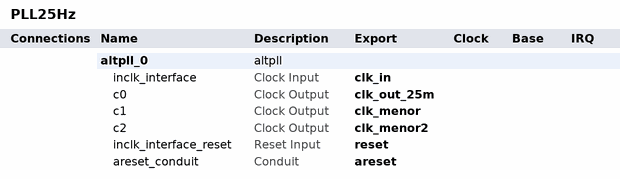
[diagram p0: system contents]
# Platform Designer (Qsys) system PLL25Hz, Cyclone IV E EP4CE115F29C7
# Parameters at their usual value, and those the tool derives, are not listed.
package require qsys
create_system PLL25Hz
set_project_property DEVICE_FAMILY {Cyclone IV E}
set_project_property DEVICE EP4CE115F29C7

add_instance altpll_0 altpll 13.1
set_instance_parameter_value altpll_0 INCLK0_INPUT_FREQUENCY 20000
set_instance_parameter_value altpll_0 CLK0_MULTIPLY_BY 1007
set_instance_parameter_value altpll_0 CLK1_MULTIPLY_BY 1
set_instance_parameter_value altpll_0 CLK2_MULTIPLY_BY 1
set_instance_parameter_value altpll_0 CLK0_DIVIDE_BY 2000
set_instance_parameter_value altpll_0 CLK1_DIVIDE_BY 5000
set_instance_parameter_value altpll_0 CLK2_DIVIDE_BY 500
set_instance_parameter_value altpll_0 CLK1_PHASE_SHIFT 0
set_instance_parameter_value altpll_0 CLK2_PHASE_SHIFT 0
set_instance_parameter_value altpll_0 CLK1_DUTY_CYCLE 50
set_instance_parameter_value altpll_0 CLK2_DUTY_CYCLE 50
set_instance_parameter_value altpll_0 PORT_clk1 PORT_USED
set_instance_parameter_value altpll_0 PORT_clk2 PORT_USED
set_instance_parameter_value altpll_0 PORT_clk3 PORT_UNUSED
set_instance_parameter_value altpll_0 PORT_ARESET PORT_UNUSED
set_instance_parameter_value altpll_0 PORT_LOCKED PORT_UNUSED

# exported interfaces
add_interface clk_in clock sink
set_interface_property clk_in EXPORT_OF altpll_0.inclk_interface
add_interface reset reset sink
set_interface_property reset EXPORT_OF altpll_0.inclk_interface_reset
add_interface clk_out_25m clock source
set_interface_property clk_out_25m EXPORT_OF altpll_0.c0
add_interface areset conduit end
set_interface_property areset EXPORT_OF altpll_0.areset_conduit
add_interface clk_menor clock source
set_interface_property clk_menor EXPORT_OF altpll_0.c1
add_interface clk_menor2 clock source
set_interface_property clk_menor2 EXPORT_OF altpll_0.c2

set_interconnect_requirement {$system} qsys_mm.clockCrossingAdapter HANDSHAKE
set_interconnect_requirement {$system} qsys_mm.maxAdditionalLatency 1
set_interconnect_requirement {$system} qsys_mm.insertDefaultSlave false

save_system PLL25Hz.qsys
